# Altium schematic sheet Peripheral.SchDoc
size A4; SheetNumber: 3; SheetTotal: 4
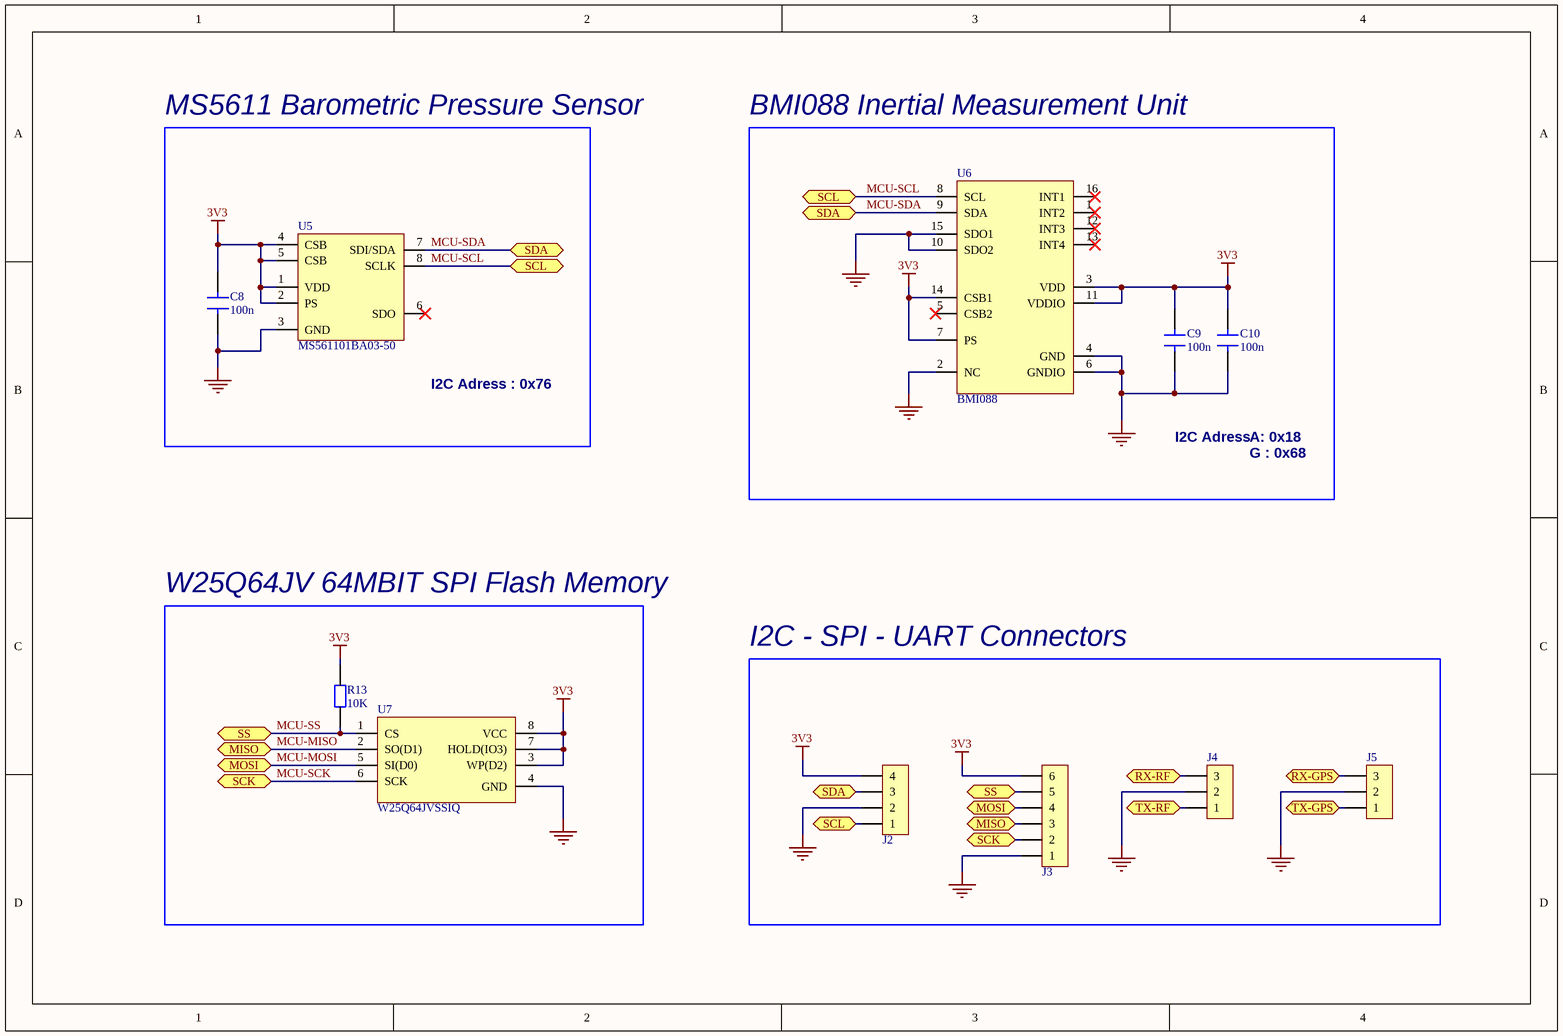
[diagram p0: Peripheral.SchDoc]

## Parts
C8  100n  [CAP 0603]
C9  100n  [CAP 0603]
C10  100n  [CAP 0603]
J2  1x4 HEADER MALE  [1X4 HEADER MALE]  (value not drawn)
J3  1x6 HEADER MALE  [1X6 HEADER MALE]  (value not drawn)
J4  JST B3B-XH-A  [JST_B3B-XH-A]  (value not drawn)
J5  JST B3B-XH-A  [JST_B3B-XH-A]  (value not drawn)
R13  10K  [RES 0603]
U5  MS561101BA03-50  [MS5611-01BA3]
U6  BMI088  [BMI088]
U7  W25Q64JVSSIQ  [W25Q64JVSSIQ]

## Blocks framed on the sheet
MS5611 Barometric Pressure Sensor: C8 U5
BMI088 Inertial Measurement Unit: C9 C10 U6
W25Q64JV 64MBIT SPI Flash Memory: R13 U7
I2C - SPI - UART Connectors: J2-J5

## Ports
MISO (bidir, see MCU[5C], Peripheral[1C]), MISO (bidir, see MCU[5C], Peripheral[3D]), MOSI (bidir, see MCU[5C], Peripheral[1C]), MOSI (bidir, see MCU[5C], Peripheral[3D]), RX-GPS (bidir, see MCU[7C]), RX-RF (bidir, see MCU[7C]), SCK (bidir, see MCU[5C], Peripheral[1D]), SCK (bidir, see MCU[5C], Peripheral[3D]), SCL (bidir, see MCU[5D], Peripheral[2B], Peripheral[3A]), SCL (bidir, see MCU[5D], Peripheral[2B], Peripheral[3D]), SCL (bidir, see MCU[5D], Peripheral[3A], Peripheral[3D]), SDA (bidir, see MCU[5D], Peripheral[2A], Peripheral[3A]), SDA (bidir, see MCU[5D], Peripheral[2A], Peripheral[3D]), SDA (bidir, see MCU[5D], Peripheral[3A], Peripheral[3D]), SS (bidir, see MCU[5C], Peripheral[1C]), SS (bidir, see MCU[5C], Peripheral[3D]), TX-GPS (bidir, see MCU[7C]), TX-RF (bidir, see MCU[7C])

## Nets
3V3: C8.2 C9.2 C10.2 J2.4 J3.6 R13.2 U5.1(VDD) U5.2(PS) U5.4(CSB) U5.5(CSB) U6.3(VDD) U6.7(PS) U6.11(VDDIO) U6.14(CSB1) U7.3(WP(D2)) U7.7(HOLD(IO3)) U7.8(VCC)
GND: C8.1 C9.1 C10.1 J2.2 J3.1 J4.2 J5.2 U5.3(GND) U6.2(NC) U6.4(GND) U6.6(GNDIO) U6.10(SDO2) U6.15(SDO1) U7.4(GND)
MCU-MISO: J3.3 U7.2(SO(D1)) ; port MISO
MCU-MOSI: J3.4 U7.5(SI(D0)) ; port MOSI
MCU-SCK: J3.2 U7.6(SCK) ; port SCK
MCU-SCL: J2.1 U5.8(SCLK) U6.8(SCL) ; port SCL
MCU-SDA: J2.3 U5.7(SDI/SDA) U6.9(SDA) ; port SDA
MCU-SS: J3.5 R13.1 U7.1(CS) ; port SS
RX-GPS: J5.3 ; port RX-GPS
RX-RF: J4.3 ; port RX-RF
TX-GPS: J5.1 ; port TX-GPS
TX-RF: J4.1 ; port TX-RF

Not connected (* = marked no-connect by the designer): U5 6(SDO)*; U6 1(INT2)* 5(CSB2)* 12(INT3)* 13(INT4)* 16(INT1)*

## Notes on the sheet
- I2C Adress : 0x76
- I2C Adress
- A: 0x18
- G : 0x68

## Library data of the parts
C8-C10 = CAP 0603 50V: Capacitor SMD 0603 50V
J4 J5 = JST B3B-XH-A: Connector Header, XH Series, 3 Position, 2.50mm, Through Hole, Press-Fit, Solder, Natural; Manufacturer Part Number: B3B-XH-A(LF)(SN); Supplier 1: CoreStaff; Manufacturer: JST; RoHS: Yes; Category: Headers and Wire Housings; Stock 1: 2101; Pricing 1: 1=39,94, 10=25,1, 50=21,68, 100=18,25, 500=17,57, 1000=17,12, 2000=16,44, 4000=15,79 (JPY); ComponentLink1URL: https://datasheet.ciiva.com/26894/getdatasheetpartid-640434-26894454.pdf?src-supplier=Verical; ComponentLink1Description: https://datasheet.ciiva.com/26894/getdatasheetpartid-640434-26894454.pdf?src-supplier=Verical; ComponentLink2URL: https://datasheet.ciiva.com/26894/getdatasheetpartid-440399-26894778.pdf?src-supplier=Verical; ComponentLink2Description: https://datasheet.ciiva.com/26894/getdatasheetpartid-440399-26894778.pdf?src-supplier=Verical; ComponentLink3URL: https://datasheet.ciiva.com/11746/0900766b8082653f-11746520.pdf?src-supplier=Rs; ComponentLink3Description: https://datasheet.ciiva.com/11746/0900766b8082653f-11746520.pdf?src-supplier=Rs
R13 = RES 0603: Resistor SMD 0603
U5 = MS561101BA03-50: Pressure Sensor 1.44V to 3.6V 0.01bar to 1.2bar Absolute 8-Pin QFN T/R; Manufacturer: TE Connectivity; Supplier 1: Arrow Electronics; Manufacturer Part Number: MS561101BA03-50; RoHS: Yes; Category: Pressure Sensors; Stock 1: 1119; Pricing 1: 1=6,627, 10=6,524, 25=6,422, 100=6,32, 250=6,218, 500=6,115, 1000=6,013 (USD); ComponentLink1URL: http://www.farnell.com/datasheets/2917208.pdf?src-supplier=Farnell; ComponentLink1Description: http://www.farnell.com/datasheets/2917208.pdf?src-supplier=Farnell; ComponentLink2URL: https://www.te.com/commerce/DocumentDelivery/DDEController?Action=srchrtrv&DocNm=MS5611-01BA03&DocType=Data+Sheet&DocLang=English&src-supplier=Digi-Key; ComponentLink2Description: https://www.te.com/commerce/DocumentDelivery/DDEController?Action=srchrtrv&DocNm=MS5611-01BA03&DocType=Data+Sheet&DocLang=English&src-supplier=Digi-Key; ComponentLink3URL: https://datasheet.octopart.com/MS561101BA03-50-TE-Connectivity-datasheet-21074432.pdf?src-supplier=Element14; ComponentLink3Description: https://datasheet.octopart.com/MS561101BA03-50-TE-Connectivity-datasheet-21074432.pdf?src-supplier=Element14; ComponentLink4URL: http://www.farnell.com/datasheets/1756128.pdf?src-supplier=Newark; ComponentLink4Description: http://www.farnell.com/datasheets/1756128.pdf?src-supplier=Newark; ComponentLink5URL: https://datasheet.octopart.com/MS561101BA03-50-TE-Connectivity-datasheet-65793092.pdf?src-supplier=Future+Electronics; ComponentLink5Description: https://datasheet.octopart.com/MS561101BA03-50-TE-Connectivity-datasheet-65793092.pdf?src-supplier=Future+Electronics; ComponentLink6URL: https://datasheet.octopart.com/MS561101BA03-50-TE-Connectivity-datasheet-134530980.pdf?src-supplier=Master+Electronics; ComponentLink6Description: https://datasheet.octopart.com/MS561101BA03-50-TE-Connectivity-datasheet-134530980.pdf?src-supplier=Master+Electronics
U6 = BMI088: BMI088 Series 3.6 V 6 Axis Digital Output Accelerometer Motion Sensor - LGA-16; Manufacturer: Bosch Tools; Supplier 1: Arrow Electronics; Manufacturer Part Number: BMI088; RoHS: No; Category: Inertial Measurement Units (IMUs); Stock 1: 2228; Pricing 1: 1=3,4884, 10=3,3155, 25=3,2816, 50=3,2477, 100=3,2147, 500=3,1828 (USD); ComponentLink1URL: https://ae-bst.resource.bosch.com/media/_tech/media/product_flyer/Bosch_Sensortec_Product_flyer_BMI088.pdf?src-supplier=Digi-Key; ComponentLink1Description: https://ae-bst.resource.bosch.com/media/_tech/media/product_flyer/Bosch_Sensortec_Product_flyer_BMI088.pdf?src-supplier=Digi-Key; ComponentLink2URL: https://ae-bst.resource.bosch.com/media/_tech/media/application_notes/BST-MIS-HS001.pdf?src-supplier=Digi-Key; ComponentLink2Description: https://ae-bst.resource.bosch.com/media/_tech/media/application_notes/BST-MIS-HS001.pdf?src-supplier=Digi-Key
U7 = W25Q64JVSSIQ: IC FLASH 64MBIT 104MHZ 8SOIC; Manufacturer: Winbond; Memory Type: Non-Volatile,FLASH; Frequency: 133MHz; Memory Size: 64Mb; Supplier 1: Digi-Key; Manufacturer Part Number: W25Q64JVSSIQ; RoHS: Yes; Category: Flash; Stock 1: 138661; Pricing 1: 1=1,03, 25=0,9212, 100=0,8173, 500=0,7987, 5000=0,72112 (USD); Mount: Surface Mount; Case/Package: SOIC; Number of Pins: 8; Min Operating Temperature: -40°C; Max Operating Temperature: 85°C; Packaging: Rail/Tube; Series: SpiFlash®; RoHS Compliant: Yes; ComponentLink1URL: http://www.winbond.com/resource-files/w25q64jv%20revj%2003272018%20plus.pdf?src-supplier=Digi-Key; ComponentLink1Description: http://www.winbond.com/resource-files/w25q64jv%20revj%2003272018%20plus.pdf?src-supplier=Digi-Key